# EAGLE design ReflectanceSensorBreakout_Alpha1a (EAGLE 8.3.1)
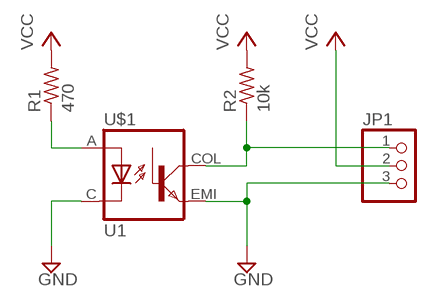
[diagram p0: schematic, sheet 1]

## Parts
JP1  PINHD-1X3  [1X03]
R1  470  R-US_0204/7  [0204/7]
R2  10k  R-US_0204/7  [0204/7]
U$1  U1  ADAFRUIT_REFLECTANCE_SENSOR  [ADAFRUIT_REFLECTANCE_SENSOR]

## Nets
GND: JP1.3 U$1.C U$1.EMI
N$1: R1.1 U$1.A
N$2: JP1.1 R2.1 U$1.COL
VCC: JP1.2 R1.2 R2.2

## Library data of the parts
JP1 = adafruit:PINHD-1X3: PIN HEADER
R1 R2 = rcl:R-US_: RESISTOR, American symbol
U$1 = Pavel_opto:ADAFRUIT_REFLECTANCE_SENSOR

## Board
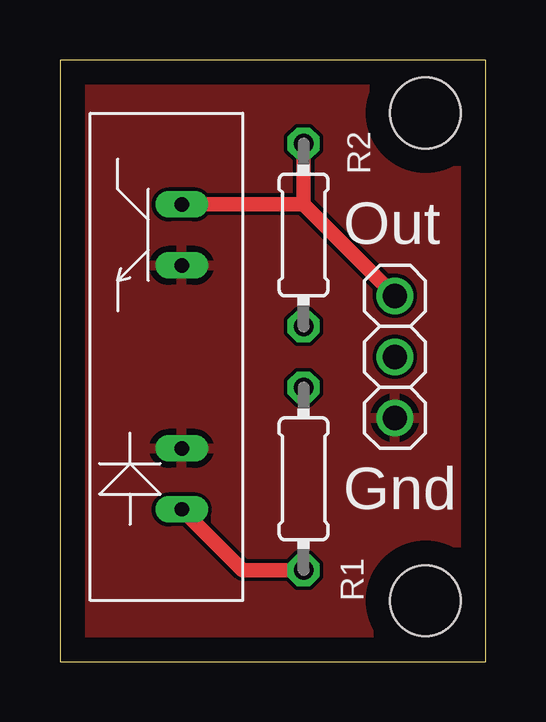
[diagram p1: board, top side]
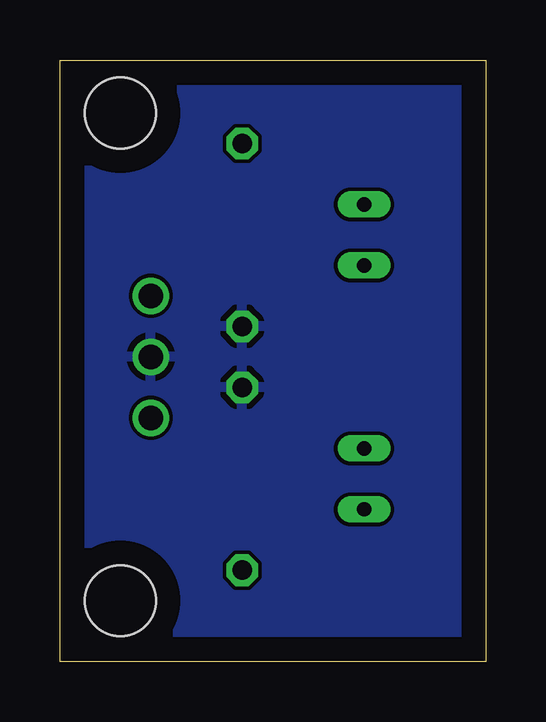
[diagram p2: board, bottom side, seen from below]

Size 17.76 x 25.07 mm. Coordinates in mm from the lower left corner, seen from the top.
Outline: 0,0 17.76,0 17.76,25.07 0,25.07 0,0
Copper layers (1*16): Top 0.035mm / dielectric 1.5mm / Bottom 0.035mm
Design rules "default": minimum track width 6mil, minimum drill 0.35mm, track to track 6mil, track to pad 6mil, pad to pad 6mil, via to via 6mil, smd to smd 6mil, copper to edge 40mil, drill to drill 6mil, minimum pad ring 10mil, minimum via ring 8mil, stop-mask expansion 4mil, vias tented up to drill 0mil, thermal gap 10mil
Holes 2.95 mm at 15.24,22.86 15.24,2.54

### Footprints (pad centres in the part's own frame; a part is rotated, then mirrored left to right if it is on the bottom)
1X03 = drill 1.016: 1 -2.54,0; 2 0,0; 3 2.54,0
0204/7 = drill 0.813 octagon: 1 -3.81,0; 2 3.81,0
ADAFRUIT_REFLECTANCE_SENSOR = drill 0.6 long: A -6.35,0; C -3.81,0; COL 6.35,0; EMI 3.81,0

### Placement (x,y rotation side)
JP1  13.97,12.7 270 top
R1  10.16,7.62 90 top
R2  10.16,17.78 270 top
U$1  5.08,12.7 90 top

### Tracks (layer width: path | path; a pad name or v marks a point on that pad's centre or on a via)
GND
  pour Top: -2.54,34.29 -2.54,-1.27 30.48,-1.27 30.48,34.29
N$1
  Top 0.61: R1.1 7.62,3.81 U$1.A
N$2
  Top 0.61: 10.16,19.05 U$1.COL | R2.1 10.16,19.05 | JP1.1 10.16,19.05
VCC
  pour Bottom: -2.54,35.56 -2.54,-1.27 31.75,-1.27 31.75,35.56

### Text on the board
tPlace: Out | Gnd